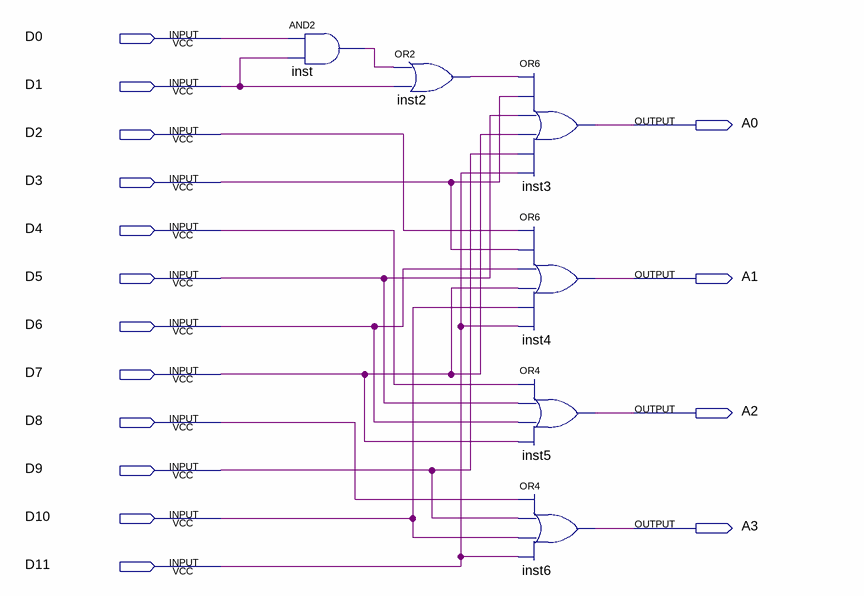
[diagram p0: schematic sheet]
// Quartus schematic decimalToBinaryEncoder.bdf as structural Verilog: 6 symbols, 16 pins
module decimalToBinaryEncoder (
  input  D0,
  input  D1,
  input  D2,
  input  D3,
  input  D4,
  input  D5,
  input  D6,
  input  D7,
  input  D8,
  input  D9,
  input  D10,
  input  D11,
  output A0,
  output A1,
  output A2,
  output A3
);

  wire inst2_out, inst_out;

  and inst (inst_out, D0, D1);
  or inst2 (inst2_out, inst_out, D1);
  or inst3 (A0, inst2_out, D3, D5, D7, D9, D11);
  or inst4 (A1, D2, D3, D6, D7, D10, D11);
  or inst5 (A2, D4, D5, D6, D7);
  or inst6 (A3, D8, D9, D10, D11);
endmodule
